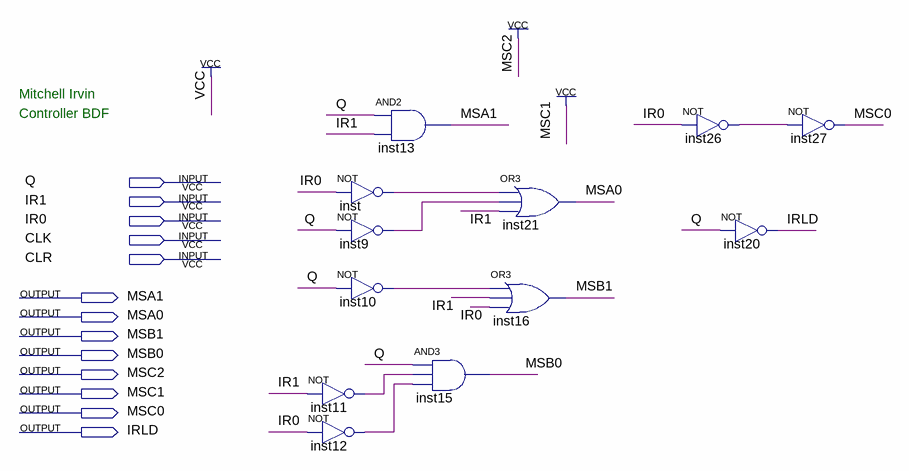
[diagram p0: schematic sheet]
// Quartus schematic controller.bdf as structural Verilog: 12 symbols, 13 pins
module controller (
  input  Q,
  input  IR1,
  input  IR0,
  input  CLK,
  input  CLR,
  output MSA1,
  output MSA0,
  output MSB1,
  output MSB0,
  output MSC2,
  output MSC1,
  output MSC0,
  output IRLD
);

  wire inst9_out, inst10_out, inst11_out, inst12_out, inst26_out, inst_out;

  and inst13 (MSA1, Q, IR1);
  not inst (inst_out, IR0);
  not inst9 (inst9_out, Q);
  not inst10 (inst10_out, Q);
  not inst11 (inst11_out, IR1);
  not inst12 (inst12_out, IR0);
  and inst15 (MSB0, Q, inst11_out, inst12_out);
  or inst21 (MSA0, inst_out, inst9_out, IR1);
  or inst16 (MSB1, inst10_out, IR1, IR0);
  not inst26 (inst26_out, IR0);
  not inst20 (IRLD, Q);
  not inst27 (MSC0, inst26_out);

  assign MSC1 = 1'b1;
  assign MSC2 = 1'b1;

  // Notes on the sheet:
  //   Mitchell Irvin
  //   Controller BDF
endmodule
